# EAGLE design CurrentSensor (EAGLE 6.1)
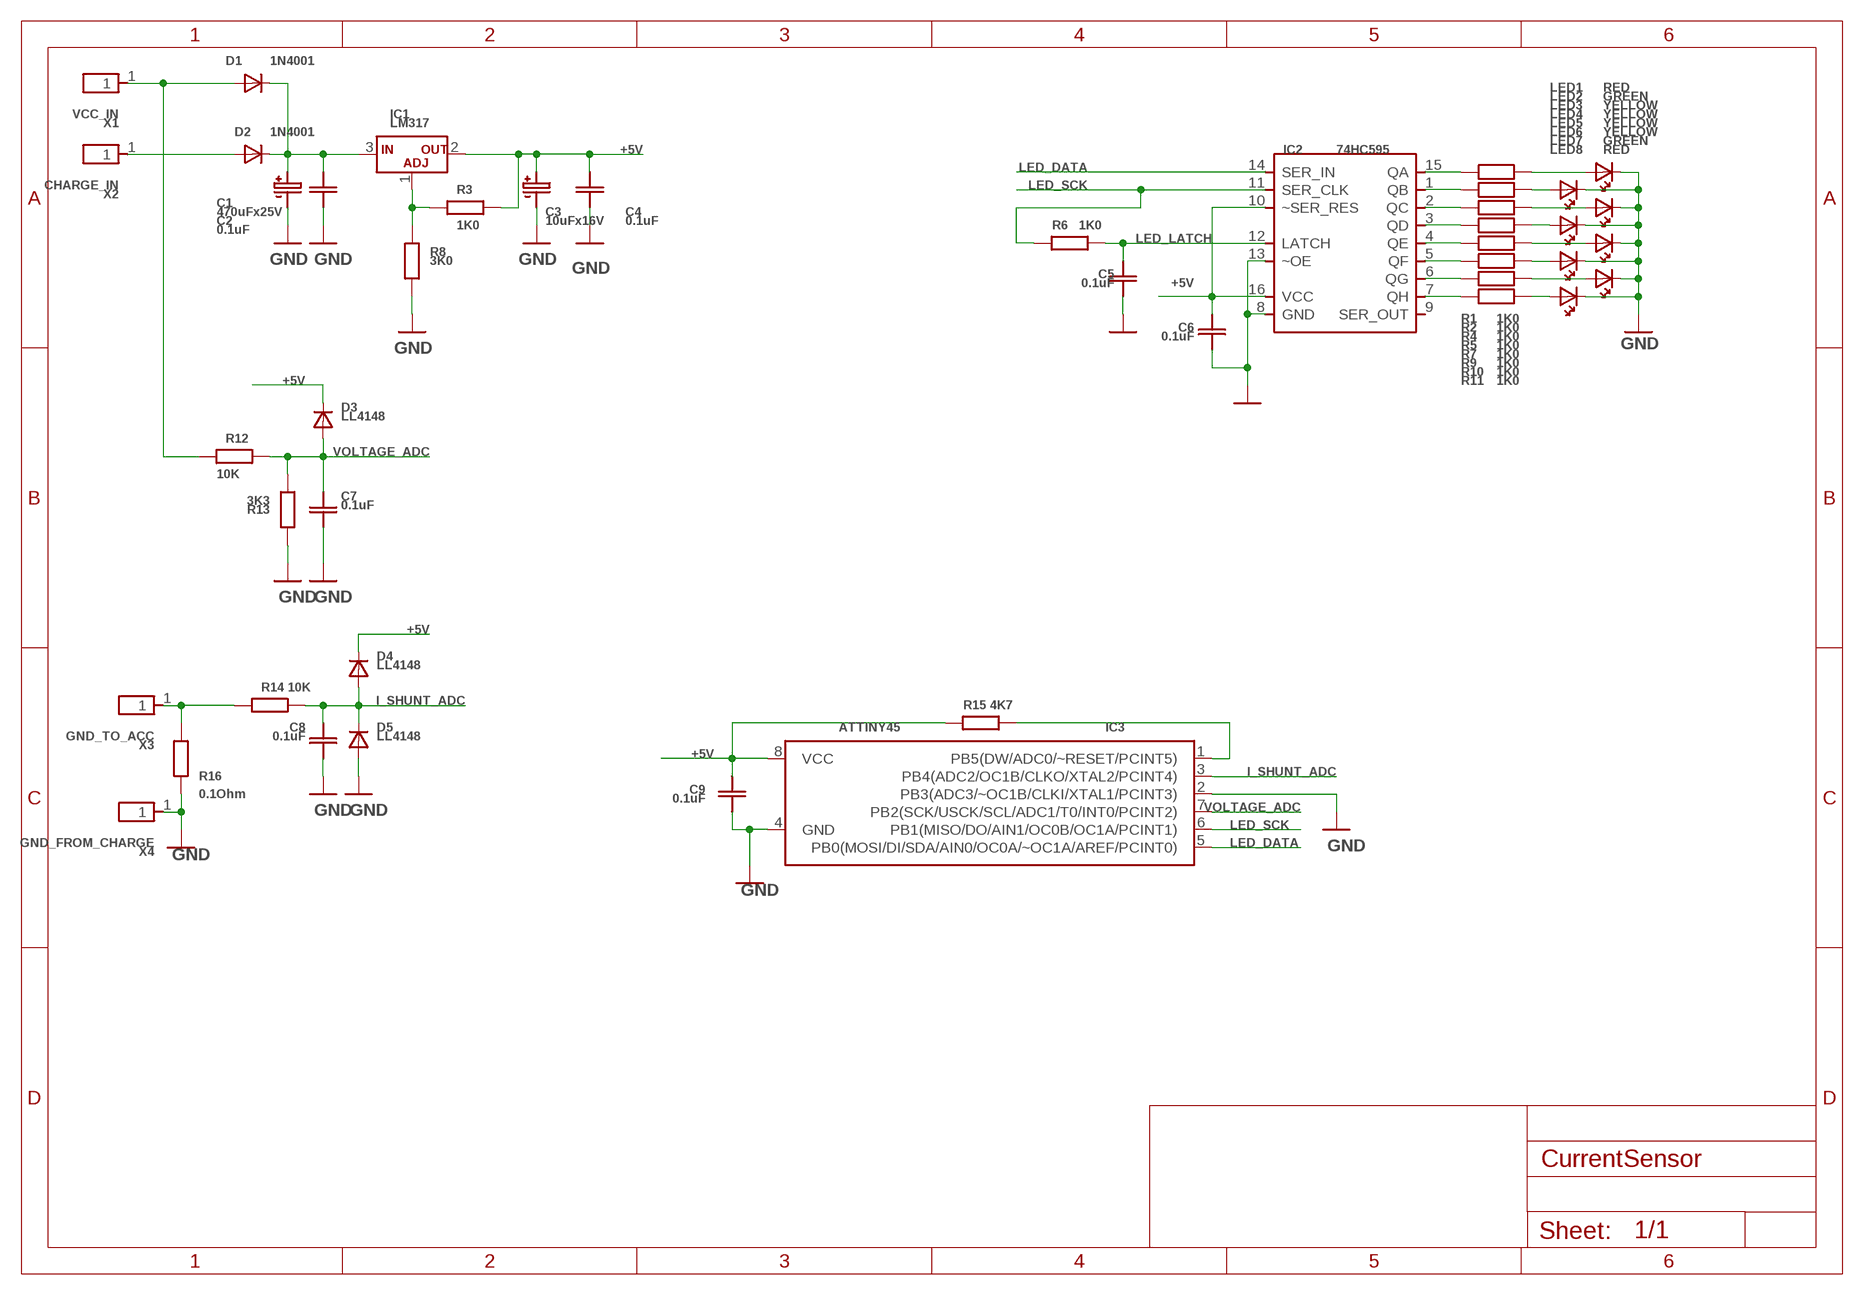
[diagram p0: schematic, sheet 1]

## Parts
C1  470uFx25V  CE6.3MM  [CE_6.3MM]
C2  0.1uF  CSMD_0805  [RSMD_0805]
C3  10uFx16V  CE5.2MM  [CE_5.2MM]
C4  0.1uF  CSMD_0805  [RSMD_0805]
C5  0.1uF  CSMD_0805  [RSMD_0805]
C6  0.1uF  CSMD_0805  [RSMD_0805]
C7  0.1uF  CSMD_0805  [RSMD_0805]
C8  0.1uF  CSMD_0805  [RSMD_0805]
C9  0.1uF  CSMD_0805  [RSMD_0805]
D1  1N4001  1N4001DO-41_10MM  [DO-41_10MM]
D2  1N4001  1N4001DO-41_10MM  [DO-41_10MM]
D3  LL4148  LL4147SOD-80  [SOD-80]
D4  LL4148  LL4147SOD-80  [SOD-80]
D5  LL4148  LL4147SOD-80  [SOD-80]
IC1  LM317  LM317(D2PAK)  [D2PAK]
IC2  74HC595  74HC595(SOIC16)  [SOIC16]
IC3  ATTINY45  ATTINY45(SOIC8-0.15'')  [SOIC8(0.15'')]
LED1  RED  LED3MM  [LED3MM]
LED2  GREEN  LED3MM  [LED3MM]
LED3  YELLOW  LED3MM  [LED3MM]
LED4  YELLOW  LED3MM  [LED3MM]
LED5  YELLOW  LED3MM  [LED3MM]
LED6  YELLOW  LED3MM  [LED3MM]
LED7  GREEN  LED3MM  [LED3MM]
LED8  RED  LED3MM  [LED3MM]
R1  1K0  RSMD_1206  [RSMD_1206]
R2  1K0  RSMD_0805  [RSMD_0805]
R3  1K0  RSMD_0805  [RSMD_0805]
R4  1K0  RSMD_0805  [RSMD_0805]
R5  1K0  RSMD_0805  [RSMD_0805]
R6  1K0  RSMD_0805  [RSMD_0805]
R7  1K0  RSMD_0805  [RSMD_0805]
R8  3K0  RSMD_0805  [RSMD_0805]
R9  1K0  RSMD_0805  [RSMD_0805]
R10  1K0  RSMD_0805  [RSMD_0805]
R11  1K0  RSMD_0805  [RSMD_0805]
R12  10K  RSMD_1206_BIG_GAP  [RSMD_1206_BIG_GAP]
R13  3K3  RSMD_0805  [RSMD_0805]
R14  10K  RSMD_0805  [RSMD_0805]
R15  4K7  RSMD_0805  [RSMD_0805]
R16  0.1Ohm  R1.0W  [R_1.0W]
X1  VCC_IN  PIN1X13.5MM_SIDE_BOARD  [PIN1X1_3.5MM_SIDE_BOARD]
X2  CHARGE_IN  PIN1X13.5MM_SIDE_BOARD  [PIN1X1_3.5MM_SIDE_BOARD]
X3  GND_TO_ACC  PIN1X13.5MM_SIDE_BOARD  [PIN1X1_3.5MM_SIDE_BOARD]
X4  GND_FROM_CHARGE  PIN1X13.5MM_SIDE_BOARD  [PIN1X1_3.5MM_SIDE_BOARD]

## Nets
+5V: C3.PLUS C4.PAD_0(PIN0) C6.PAD_0(PIN0) C9.PAD_0(PIN0) D3.CATHODE D4.CATHODE IC1.2(OUT) IC2.10(~SER_RES) IC2.16(VCC) IC3.8(VCC) R3.PAD_1(PIN1) R15.PAD_0(PIN0)
GND: C1.MINUS C2.PAD_1(PIN1) C3.MINUS C4.PAD_1(PIN1) C5.PAD_1(PIN1) C6.PAD_1(PIN1) C7.PAD_1(PIN1) C8.PAD_1(PIN1) C9.PAD_1(PIN1) D5.ANODE IC2.8(GND) IC2.13(~OE) IC3.2(PB3(ADC3/~OC1B/CLKI/XTAL1/PCINT3)) IC3.4(GND) LED1.CATHODE LED2.CATHODE LED3.CATHODE LED4.CATHODE LED5.CATHODE LED6.CATHODE LED7.CATHODE LED8.CATHODE R8.PAD_0(PIN0) R13.PAD_0(PIN0) R16.PAD1(PIN1) X4.1
I_SHUNT_ADC: C8.PAD_0(PIN0) D4.ANODE D5.CATHODE IC3.3(PB4(ADC2/OC1B/CLKO/XTAL2/PCINT4)) R14.PAD_1(PIN1)
LED_DATA: IC2.14(SER_IN) IC3.5(PB0(MOSI/DI/SDA/AIN0/OC0A/~OC1A/AREF/PCINT0))
LED_LATCH: C5.PAD_0(PIN0) IC2.12(LATCH) R6.PAD_1(PIN1)
LED_SCK: IC2.11(SER_CLK) IC3.6(PB1(MISO/DO/AIN1/OC0B/OC1A/PCINT1)) R6.PAD_0(PIN0)
N$1: IC2.6(QG) R10.PAD_0(PIN0)
N$2: IC2.7(QH) R11.PAD_0(PIN0)
N$3: LED7.ANODE R10.PAD_1(PIN1)
N$4: LED4.ANODE R5.PAD_1(PIN1)
N$5: IC3.1(PB5(DW/ADC0/~RESET/PCINT5)) R15.PAD_1(PIN1)
N$17: C1.PLUS C2.PAD_0(PIN0) D1.CATHODE D2.CATHODE IC1.3(IN)
N$19: LED1.ANODE R1.PAD_1(PIN1)
N$20: LED3.ANODE R4.PAD_1(PIN1)
N$21: LED6.ANODE R9.PAD_1(PIN1)
N$23: LED8.ANODE R11.PAD_1(PIN1)
N$24: LED2.ANODE R2.PAD_1(PIN1)
N$28: LED5.ANODE R7.PAD_1(PIN1)
N$30: IC2.15(QA) R1.PAD_0(PIN0)
N$31: IC2.1(QB) R2.PAD_0(PIN0)
N$32: IC2.2(QC) R4.PAD_0(PIN0)
N$33: IC2.3(QD) R5.PAD_0(PIN0)
N$34: IC2.4(QE) R7.PAD_0(PIN0)
N$35: IC2.5(QF) R9.PAD_0(PIN0)
N$36: R14.PAD_0(PIN0) R16.PAD_0(PIN0) X3.1
N$37: D1.ANODE R12.PAD_0(PIN0) X1.1
N$38: D2.ANODE X2.1
N$39: IC1.1(ADJ) R3.PAD_0(PIN0) R8.PAD_1(PIN1)
VOLTAGE_ADC: C7.PAD_0(PIN0) D3.ANODE IC3.7(PB2(SCK/USCK/SCL/ADC1/T0/INT0/PCINT2)) R12.PAD_1(PIN1) R13.PAD_1(PIN1)
Unconnected: IC2.9(SER_OUT)

## Library data of the parts
C1 C3 = __MyCommonLib1:CE
C2 C4-C9 = __MyCommonLib1:C
D1 D2 = __MyCommonLib1:1N4001
D3-D5 = __MyCommonLib1:LL4147
IC1 = __MyCommonLib1:LM317
IC2 = __MyCommonLib1:74HC595
IC3 = __MyCommonLib1:ATTINY45
LED1-LED8 = __MyCommonLib1:LED3MM
R1-R16 = __MyCommonLib1:R
X1-X4 = __MyCommonLib1:PIN1X1

## Board
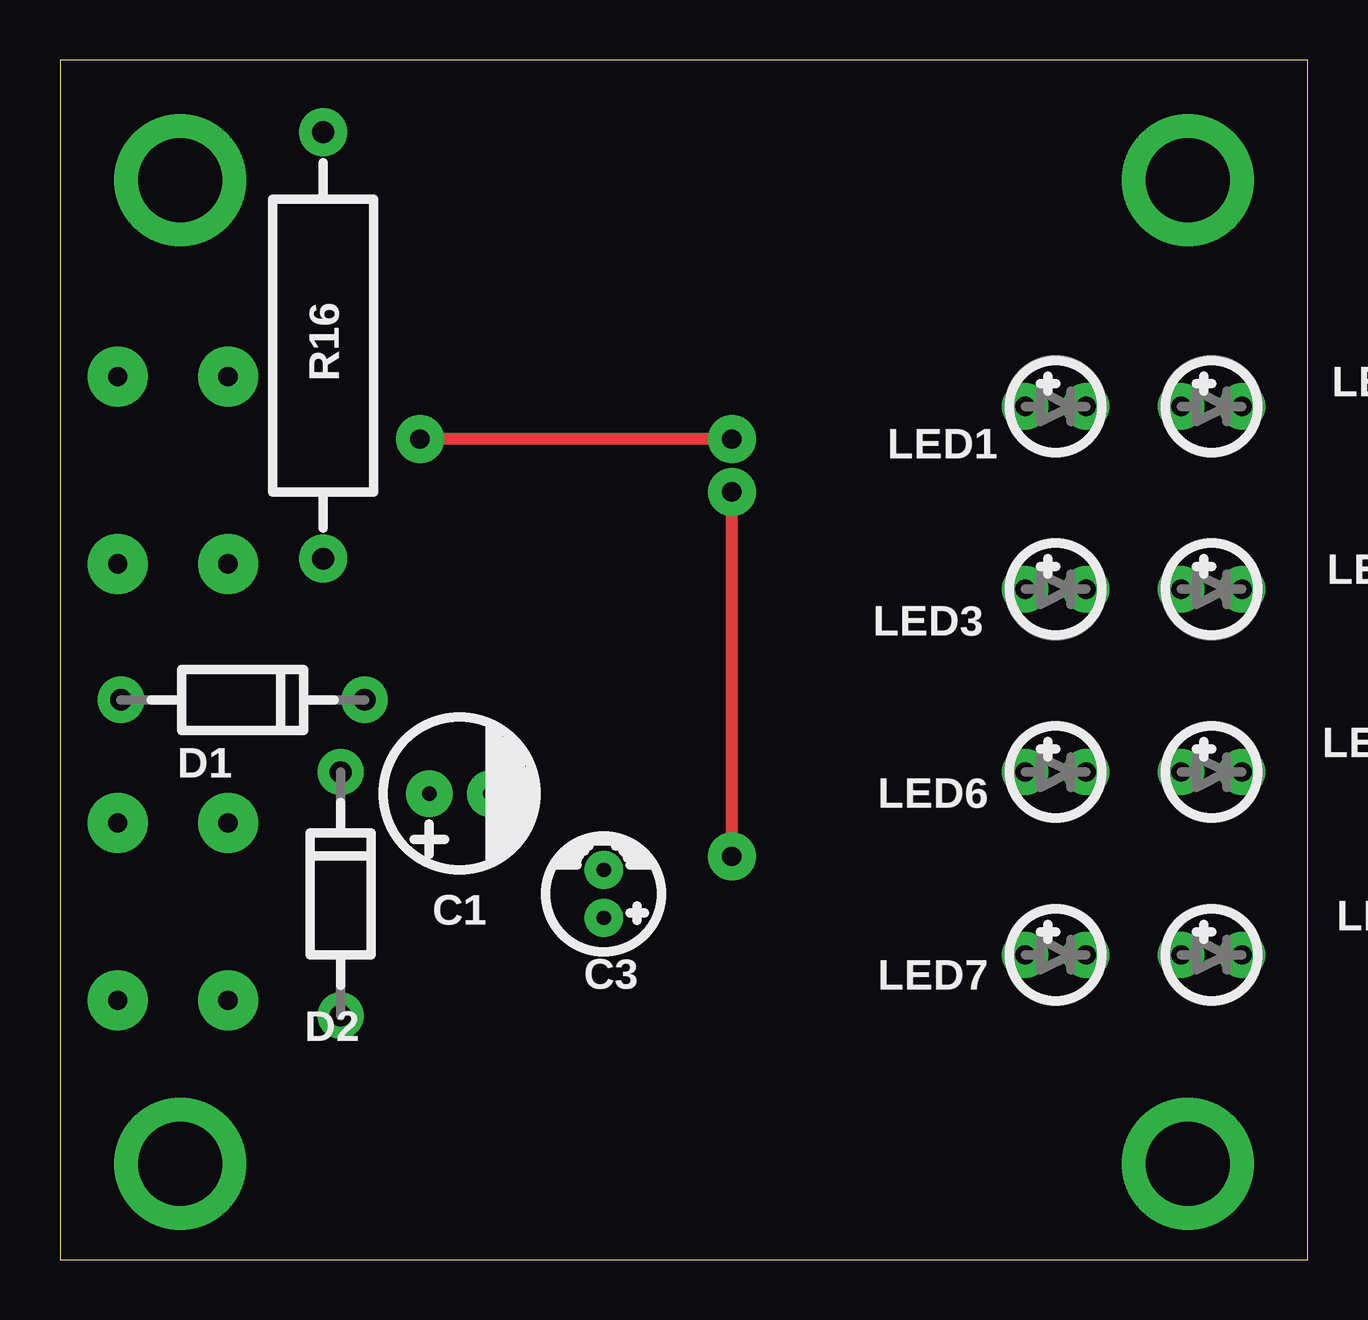
[diagram p1: board, top side]
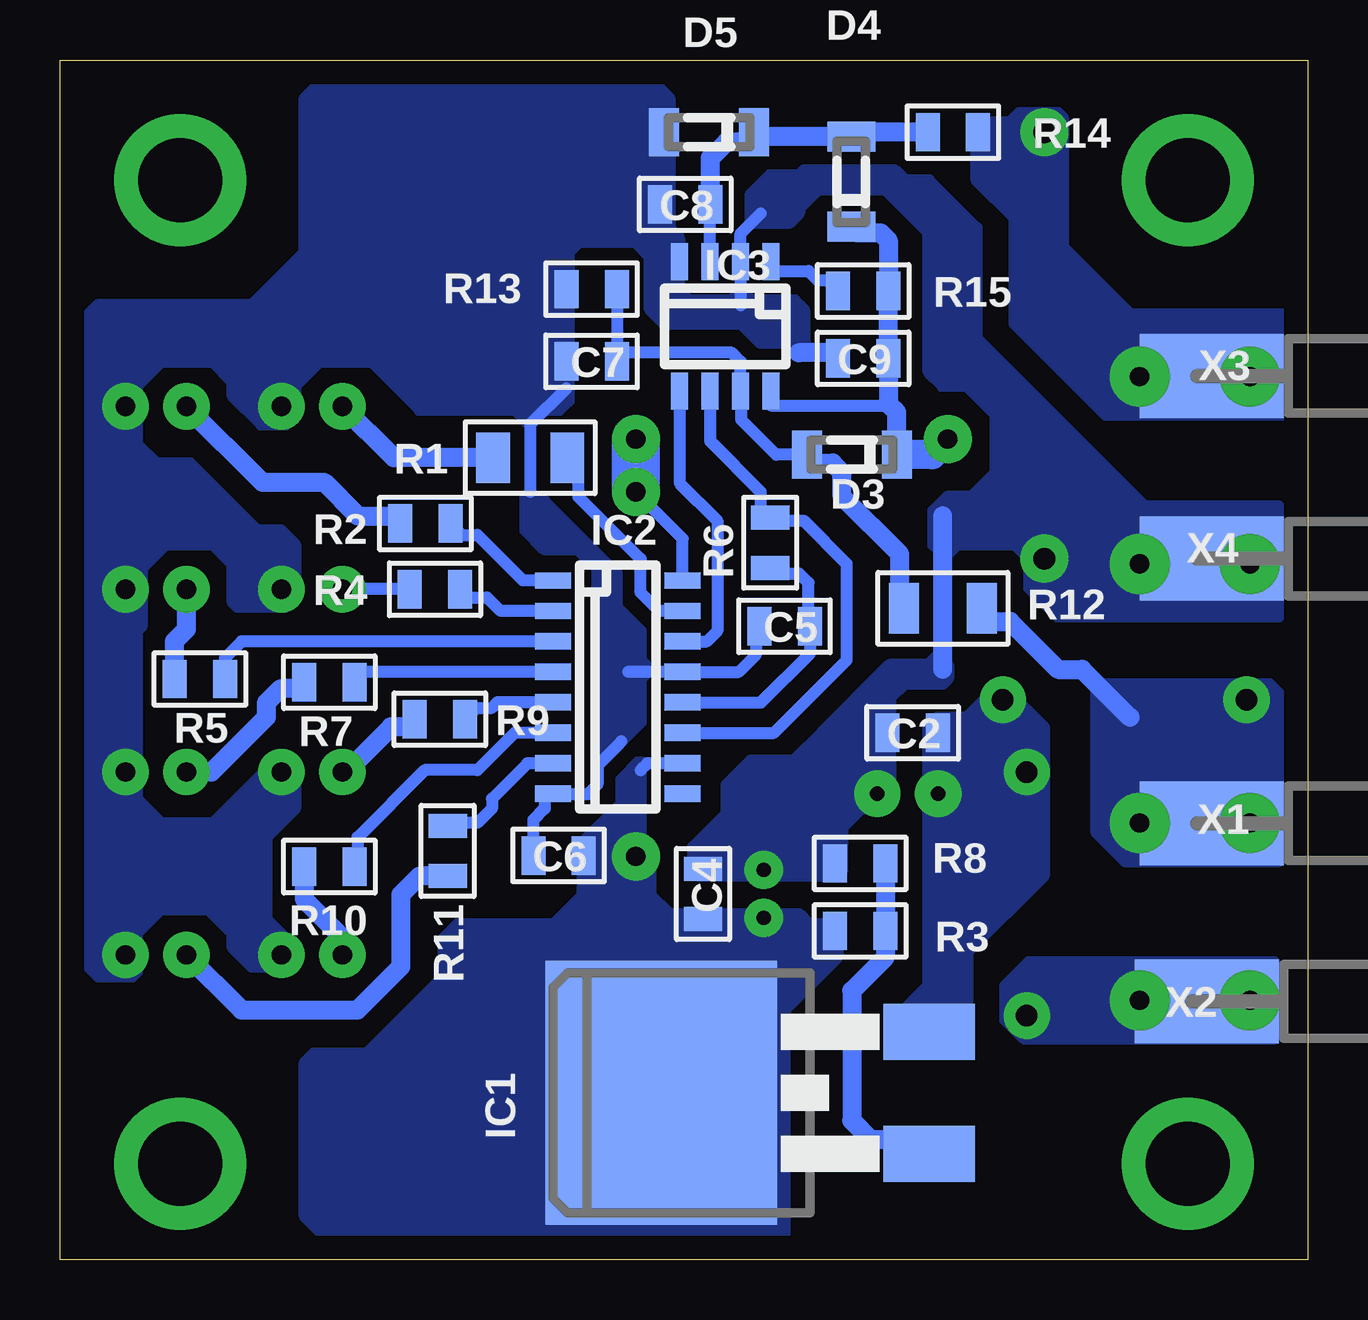
[diagram p2: board, bottom side, seen from below]

Size 52 x 50 mm. Coordinates in mm from the lower left corner, seen from the top.
Outline: 0,0 52,0 52,50 0,50 0,0
Copper layers (1*16): Top 0.035mm / dielectric 1.5mm / Bottom 0.035mm
Design rules: minimum track width 10mil, minimum drill 0.6mm, track to track 0.35mm, track to pad 0.35mm, pad to pad 0.35mm, via to via 0.35mm, smd to smd 0mil, copper to edge 1mm, drill to drill 8mil, minimum pad ring 10mil, minimum via ring 8mil, stop-mask expansion 4mil, vias tented up to drill 0mil, thermal gap 10mil

### Footprints (pad centres in the part's own frame; a part is rotated, then mirrored left to right if it is on the bottom)
CE_6.3MM = drill 0.6 pad 1.93: MINUS -1.27,0; PLUS 1.27,0
RSMD_0805 = smd 1 x 1.6: PAD_0 -1.05,0; PAD_1 1.05,0
CE_5.2MM = drill 0.6 pad 1.6: MINUS -1,0; PLUS 1,0
DO-41_10MM = drill 0.9 pad 1.93: ANODE -5.08,0; CATHODE 5.08,0
SOD-80 = smd 1.25 x 2: ANODE 1.875,0; CATHODE -1.875,0
D2PAK = smd 2.32 x 3.81: 1 -2.54,-11.17; 3 2.54,-11.17 | smd 11 x 9.65: 2 0,0
SOIC16 = smd 1.5 x 0.68: 1 -2.699,4.445; 2 -2.699,3.175; 3 -2.699,1.905; 4 -2.699,0.635; 5 -2.699,-0.635; 6 -2.699,-1.905; 7 -2.699,-3.175; 8 -2.699,-4.445; 9 2.699,-4.445; 10 2.699,-3.175; 11 2.699,-1.905; 12 2.699,-0.635; 13 2.699,0.635; 14 2.699,1.905; 15 2.699,3.175; 16 2.699,4.445
SOIC8(0.15'') = smd 1.55 x 0.7: 1 -2.7,1.905; 2 -2.7,0.635; 3 -2.7,-0.635; 4 -2.7,-1.905; 5 2.7,-1.905; 6 2.7,-0.635; 7 2.7,0.635; 8 2.7,1.905
LED3MM = drill 0.8 pad 1.93: ANODE -1.27,0; CATHODE 1.27,0
RSMD_1206 = smd 1.4 x 2.1: PAD_0 -1.55,0; PAD_1 1.55,0
RSMD_1206_BIG_GAP = smd 1.25 x 2.1: PAD_0 -1.625,0; PAD_1 1.625,0
R_1.0W = drill 0.9 pad 2: PAD1 8.89,0; PAD_0 -8.89,0
PIN1X1_3.5MM_SIDE_BOARD = smd 3.5 x 6: 1 0,3

### Placement (x,y rotation side)
C1  16.66,19.42 180 top
C2  16.46,21.96 180 bottom
C3  22.66,15.24 270 top
C4  25.2,15.24 90 bottom
C5  21.8,26.4 180 bottom
C6  31.22,16.84 180 bottom
C7  29.84,37.44 180 bottom
C8  25.94,43.98 180 bottom
C9  18.52,37.56 180 bottom
D1  7.62,23.33 0 top
D2  11.7,15.24 90 top
D3  18.99,33.55 180 bottom
D4  19.02,44.92 90 bottom
D5  24.94,46.99 180 bottom
IC1  26.94,6.95 90 bottom
IC2  28.75,23.86 0 bottom
IC3  24.27,38.9 270 bottom
LED1  41.5,35.56 0 top
LED2  48,35.56 0 top
LED3  41.5,27.94 0 top
LED4  48,27.94 0 top
LED5  48,20.32 0 top
LED6  41.5,20.32 0 top
LED7  41.5,12.7 0 top
LED8  48,12.7 0 top
R1  32.4,33.42 180 bottom
R2  36.77,30.68 180 bottom
R3  18.65,13.7 180 bottom
R4  36.37,27.94 180 bottom
R5  46.17,24.2 180 bottom
R6  22.4,29.88 270 bottom
R7  40.77,24.06 180 bottom
R8  18.65,16.51 0 bottom
R9  36.17,22.52 180 bottom
R10  40.77,16.38 180 bottom
R11  35.84,17.03 270 bottom
R12  15.2,27.14 180 bottom
R13  29.84,40.45 0 bottom
R14  14.78,46.99 180 bottom
R15  18.52,40.37 180 bottom
R16  10.97,38.1 270 top
X1  1,18.18 90 bottom
X2  1.2,10.76 90 bottom
X3  1,36.83 90 bottom
X4  1,29.21 90 bottom

### Tracks (layer width: path | path; a pad name or v marks a point on that pad's centre or on a via)
+5V  (via drill 0.8 pad 2)
  Top 0.5: v28,16.8 v28,32 | v28,34.2 v15,34.2
  Bottom 0.5: IC2.10 27.52,20.68 27.8,20.4 | 24.4,8.6 26.8,6.2 | IC2.16 26.05,30.05 v28,32 | IC3.8 22.36,35.6 17.4,35.6
  Bottom 0.8: D4.CATHODE 18.77,42.8 17.8,42.8 17.47,42.47 R15.PAD_0 C9.PAD_0 17.47,35.67 17.4,35.6 17.11,35.31 D3.CATHODE
  Bottom 1.2: v15,34.2 15.65,33.55 D3.CATHODE
  Bottom 2: v28,32 v28,34.2
  pour Bottom (no thermals): 19.6,14 19.6,12.6 21.8,10.4 21.8,1 41,1 41.8,1.8 41.8,8.2 41.4,8.6 39.2,8.6 36,11.8 36,13.4 35.4,14 31.4,14 30.2,15.2 30.2,17.4 28.6,19 28.6,20 27.8,20.8 27.8,17.6 27.4,17.2 27.4,15.2 26.6,14.4 21.2,14.4 20.8,14
GND  (via drill 0.8 pad 2.5)
  Bottom 0.5: 28.6,21.6 29.6,20.6 29.6,19.8 30,19.4 IC2.8 31.8,19.41 31.8,18.8 32.27,18.33 C6.PAD_1 | 30.89,36.31 32.4,34.8 32.4,32 | 23.64,39.77 IC3.2 23.64,42.77 22.8,43.6 | C5.PAD_1 23,26.25 23,25.2 23.7,24.5 IC2.13 28.3,24.5
  Bottom 0.8: C9.PAD_1 19.81,37.8 21.2,37.8 | 15.2,24.6 15.2,31
  other vias: 7,29 2.4,29
  pour Bottom (no thermals): 1.2,26.8 10.4,26.8 11.6,28 11.6,29.2 12.2,29.8 14.6,29.8 15,29.4 15.2,29.4 15.6,29.8 15.6,31.2 15,31.8 14,31.8 13,32.8 13,35.2 14.2,36.4 15.2,36.4 15.8,37 15.8,42.8 17.6,44.6 20.4,44.6 21.2,43.8 21.2,43.6 21.6,43.2 23.2,43.2 23.2,44.4 22.4,45.2 21.2,45.2 21,45.4 17.2,45.4 16.8,45 15.8,45 13.8,43 13.8,38.4 6.8,31.4 1.2,31.4
  pour Bottom (no thermals): 21.4,37.8 21.8,38.2 22.8,38.2 23.6,39 26.8,39 27.4,39.6 27.4,41.8 28,42.4 30.4,42.4 30.8,42 30.8,35.8 31.2,35.4 31.8,35.4 32.4,34.8 33,35.4 37,35.4 39,37.4 41.2,37.4 42.2,36.4 42.2,35.2 42.6,34.8 43.6,34.8 44.8,36 44.8,36.6 45.6,37.4 47.8,37.4 48.8,36.4 48.8,34 48,33.2 46.6,33.2 43.8,30.4 42.8,30.4 42.2,29.8 42.2,27.6 42.6,27.2 44.6,27.2 44.8,27.4 44.8,29 45.6,29.8 47.6,29.8 48.6,28.8 48.6,26.4 48.8,26.2 48.8,19.2 47.8,18.2 45.6,18.2 43,20.8 42.4,20.8 42.2,20.6 42.2,18.8 43.4,17.6 43.4,14.2 42.2,13 42.2,12.6 42.6,12.2 44,12.2 44.8,13 44.8,13.6 45.8,14.6 47.8,14.6 48.8,13.6 48.8,12 49,11.8 50.4,11.8 50.8,12.2 50.8,39.4 50.4,39.8 44,39.8 41.8,42 41.8,48.4 41.4,48.8 27,48.8 26.6,48.4 26.6,43 26.2,42.6 26.2,40.4 25.8,40 24,40 23.6,40.4 23.2,40 21.4,40 21,39.6 21,38.2 20.6,37.8
  pour Bottom (no thermals): 17.4,19.6 17.4,19 17.6,18.8 18.6,18.8 19.4,18 19.4,16.2 19.6,16 25.4,16 25.6,16.2 25.6,17.2 25,17.8 24.2,18.6 24.2,19.6 24.2,19.8 23.2,20.8 21.4,20.8 20.2,22 17.4,24.8 16.8,24.8 15.8,24.8 15.4,25.2 15,24.8 15,24.2 15.2,24 16.8,24 17.4,23.4 17.4,20.2
  pour Bottom (no thermals): 29.6,20.6 29.6,28.8 30.4,29.6 31.8,29.6 32.6,30.4 32.6,31.8 32.4,32 32,31.6 31.8,31.6 28.8,28.6 28.8,27.2 27.8,26.2 27.8,25 27.4,24.6 27.8,24.2 27.8,22.4
I_SHUNT_ADC
  Bottom 0.5: IC3.3 24.91,43.97 C8.PAD_0 | 23,47 23.05,47 D5.CATHODE
  Bottom 0.8: R14.PAD_1 18.82,46.99 D4.ANODE 22.87,46.8 D5.CATHODE | C8.PAD_0 24.89,45.91 24.2,46.6 23.4,46.6 23,47
LED_DATA
  Bottom 0.5: IC3.5 26.18,32.38 24.6,30.8 24.6,26.2 25.04,25.77 IC2.14
LED_LATCH
  Bottom 0.5: IC2.12 26.03,23.2 22.8,23.2 20.75,25.25 C5.PAD_0 20.8,26.45 20.8,28.2 21.2,28.6 22.17,28.6 R6.PAD_1
LED_SCK
  Bottom 0.5: IC3.6 24.91,34.1 22.8,32 22.8,31.33 R6.PAD_0 22.27,30.8 21,30.8 19.2,29 19.2,25 22.25,21.95 IC2.11
N$1
  Bottom 0.5: IC2.6 33.05,21.95 34.6,20.4 36.8,20.4 39.6,17.6 39.6,16.6 39.72,16.48 R10.PAD_0
N$2
  Bottom 0.5: IC2.7 32.52,20.68 34,19.2 34,18.8 34.6,18.2 35.8,18.2 35.8,18.12 R11.PAD_0
N$3
  Bottom 0.8: LED7.ANODE 40.23,13.43 41.82,15.02 R10.PAD_1
N$4
  Bottom 0.8: LED4.ANODE 46.73,26.27 47.22,25.78 R5.PAD_1
N$5
  Bottom 0.5: IC3.1 22.36,41.2 20.8,41.2 20.4,40.8 19.57,40.8 R15.PAD_1
N$6  (via drill 3.5 pad 5.5)
  other vias: 5,4
N$7  (via drill 3.5 pad 5.5)
  other vias: 5,45
N$8  (via drill 3.5 pad 5.5)
  other vias: 47,4
N$9  (via drill 3.5 pad 5.5)
  other vias: 47,45
N$17
  pour Bottom (no thermals): 12.4,23.6 11,22.2 11,16 14.2,12.8 14.2,8.6 17.2,8.6 17.2,10 15.8,11.4 15.8,22.2 15.4,22.6 14.2,22.6 13.2,23.6
N$19
  Bottom 0.8: R1.PAD_1 38.09,33.42 LED1.ANODE
N$20
  Bottom 0.5: R4.PAD_1 LED3.ANODE
N$21
  Bottom 0.8: R9.PAD_1 37.54,22.2 38.2,22.2 40.08,20.32 LED6.ANODE
N$23
  Bottom 0.8: R11.PAD_1 37.02,15.98 37.8,15.2 37.8,12.2 39.6,10.4 44.43,10.4 LED8.ANODE
N$24
  Bottom 0.8: LED2.ANODE 43.57,32.4 41,32.4 39.6,31 38.14,31 R2.PAD_1
N$28
  Bottom 0.8: R7.PAD_1 42.08,23.8 42.8,23.8 43.4,23.2 43.4,22.6 45.68,20.32 LED5.ANODE
N$30
  Bottom 0.5: IC2.15 27.04,27.04 27.8,27.8 27.8,29.2 30.4,31.8 30.4,33.42 R1.PAD_0
N$31
  Bottom 0.5: R2.PAD_0 35.24,30.2 34.6,30.2 32.7,28.3 IC2.1
N$32
  Bottom 0.5: IC2.2 33.63,27.04 34.2,27.6 34.98,27.6 R4.PAD_0
N$33
  Bottom 0.5: IC2.3 44.44,25.77 45.12,25.08 R5.PAD_0
N$34
  Bottom 0.5: IC2.4 39.72,24.5 R7.PAD_0
N$35
  Bottom 0.5: IC2.5 33.77,23.23 34,23 34.64,23 R9.PAD_0
N$36  (via drill 0.8 pad 2.5)
  other vias: 7,36.8 2.4,36.8
  pour Bottom (no thermals): 1,35.2 8.4,35.2 12.2,39 12.2,43.4 13.8,45 13.8,47.4 12.4,47.4 12,47.8 10.4,47.8 10.2,47.6 10.2,42.2 7.4,39.4 1,39.4
N$37  (via drill 0.8 pad 2.5)
  Bottom 0.8: 7.4,22.6 9.4,24.6 10.4,24.6 12.4,26.6 13.57,26.6 R12.PAD_0
  other vias: 7,18.2 2.4,18.2
  pour Bottom (no thermals): 1.2,16.6 7.6,16.6 8.8,17.8 8.8,24 1.6,24 1.2,23.6
N$38  (via drill 0.8 pad 2.5)
  other vias: 7,10.8 2.4,10.8
  pour Bottom (no thermals): 1.6,9.2 11.8,9.2 12.6,10 12.6,11.4 11.6,12.4 1.4,12.4 1.4,9.2
N$39
  Bottom 0.8: R8.PAD_1 R3.PAD_0 17.6,12.6 19,11.2 19,5.8 18.2,5 16.36,5 IC1.1
VOLTAGE_ADC
  Bottom 0.5: 23.6,36.23 IC3.7 | D3.ANODE 22.15,33.55 23.6,35 23.6,36.16 IC3.7 | IC3.7 23.64,37.44 24,37.8 28.6,37.8 28.8,37.6 28.79,37.59 C7.PAD_0 R13.PAD_1
  Bottom 0.8: R12.PAD_1 17,27.14 17,29.4 19.4,31.8 19.4,32.8 19.8,33.2 20.52,33.2 D3.ANODE